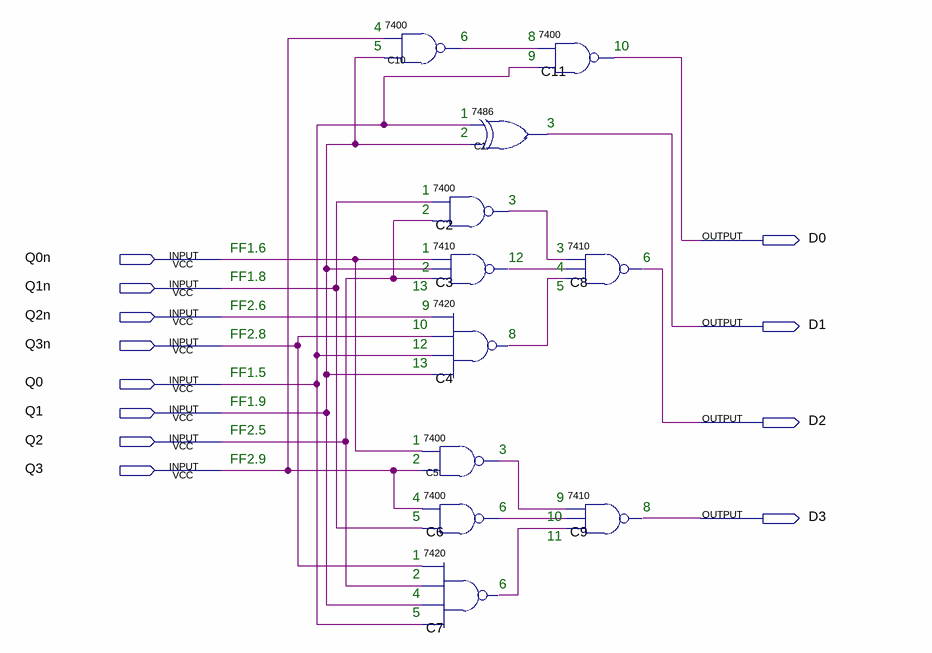
[diagram p0: schematic sheet]
// Quartus schematic control_unit.bdf as structural Verilog: 11 symbols, 12 pins
module control_unit (
  input  Q0n,
  input  Q1n,
  input  Q2n,
  input  Q3n,
  input  Q0,
  input  Q1,
  input  Q2,
  input  Q3,
  output D0,
  output D1,
  output D2,
  output D3
);

  wire C2_1, C3_1, C4_1, C5_1, C6_1, C7_1, C10_1;

  \7400  C10 (.\3 (Q1), .\2 (Q3), .\1 (C10_1));
  \7486  C1 (.\2 (Q0), .\3 (Q1), .\1 (D1));
  \7400  C2 (.\3 (Q2), .\2 (Q1n), .\1 (C2_1));
  \7410  C3 (.\2 (Q0n), .\3 (Q1), .\4 (Q2), .\1 (C3_1));
  \7420  C4 (.\4 (Q0), .\2 (Q2n), .\3 (Q3n), .\5 (Q1), .\1 (C4_1));
  \7400  C5 (.\3 (Q3), .\2 (Q0n), .\1 (C5_1));
  \7400  C6 (.\3 (Q1n), .\2 (Q3), .\1 (C6_1));
  \7420  C7 (.\4 (Q1), .\2 (Q3n), .\3 (Q2), .\5 (Q0), .\1 (C7_1));
  \7400  C11 (.\3 (Q0), .\2 (C10_1), .\1 (D0));
  \7410  C8 (.\2 (C2_1), .\3 (C3_1), .\4 (C4_1), .\1 (D2));
  \7410  C9 (.\2 (C5_1), .\3 (C6_1), .\4 (C7_1), .\1 (D3));

  // Notes on the sheet:
  //   4
  //   6
  //   8
  //   5
  //   10
  //   9
  //   1
  //   3
  //   2
  //   1
  //   3
  //   2
  //   FF1.6
  //   1
  //   3
  //   12
  //   6
  //   2
  //   4
  //   FF1.8
  //   13
  //   5
  //   FF2.6
  //   9
  //   10
  //   FF2.8
  //   8
  //   12
  //   13
  //   FF1.5
  //   FF1.9
  //   FF2.5
  //   1
  //   3
  //   FF2.9
  //   2
  //   4
  //   9
  //   6
  //   8
  //   5
  //   10
  //   11
  //   1
  //   2
  //   6
  //   4
  //   5
endmodule
